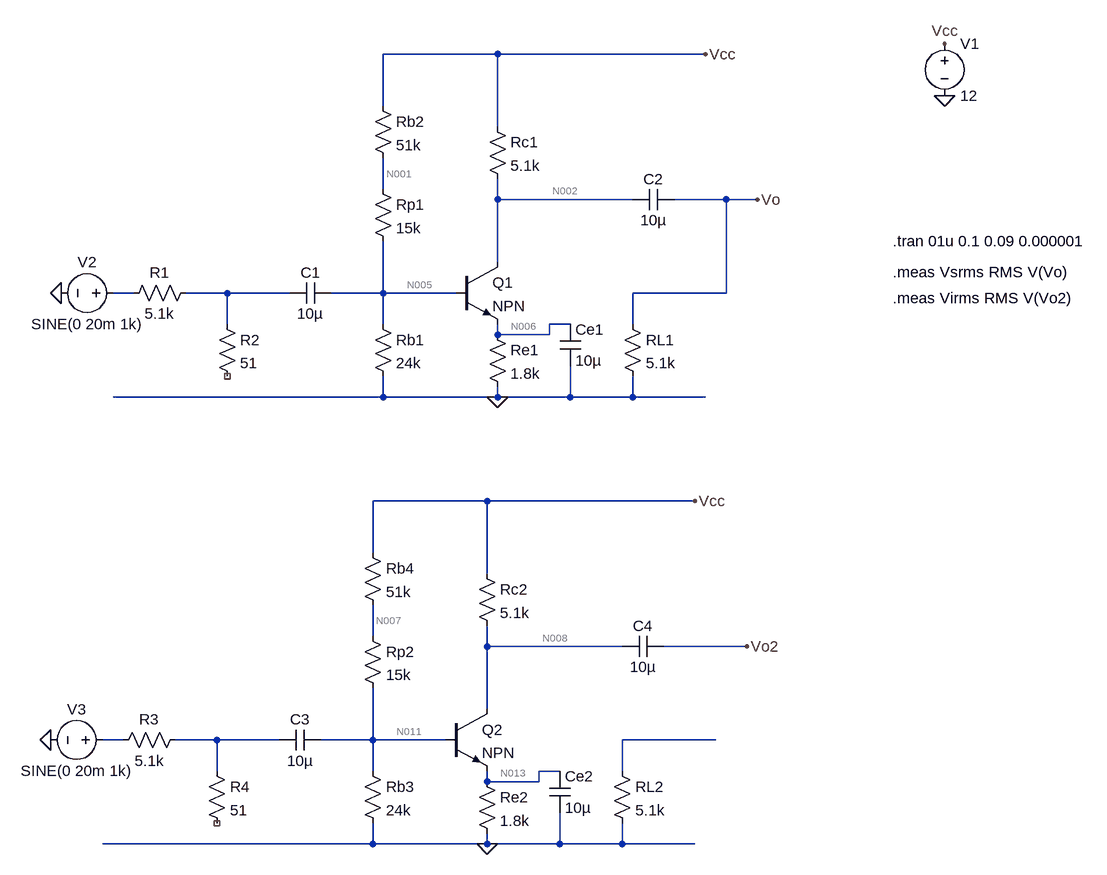
[diagram p0: schematic Experiment2_4_2.asc]
Experiment2_4_2.asc, the LTspice schematic file:
Version 4.1
SHEET 1 1064 1156
WIRE 128 -80 -48 -80
WIRE 448 -80 128 -80
WIRE -48 0 -48 -80
WIRE 128 32 128 -80
WIRE -48 128 -48 80
WIRE 128 144 128 112
WIRE 336 144 128 144
WIRE 480 144 400 144
WIRE 528 144 480 144
WIRE 128 240 128 144
WIRE -432 288 -464 288
WIRE -288 288 -352 288
WIRE -192 288 -288 288
WIRE -48 288 -48 208
WIRE -48 288 -128 288
WIRE 64 288 -48 288
WIRE 480 288 480 144
WIRE 480 288 336 288
WIRE -288 336 -288 288
WIRE -48 336 -48 288
WIRE 240 336 208 336
WIRE 336 336 336 288
WIRE 128 352 128 336
WIRE 208 352 208 336
WIRE 208 352 128 352
WIRE -48 448 -48 416
WIRE -48 448 -464 448
WIRE 128 448 128 432
WIRE 128 448 -48 448
WIRE 240 448 240 400
WIRE 240 448 128 448
WIRE 336 448 336 416
WIRE 336 448 240 448
WIRE 448 448 336 448
WIRE 112 608 -64 608
WIRE 432 608 112 608
WIRE -64 688 -64 608
WIRE 112 720 112 608
WIRE -64 816 -64 768
WIRE 112 832 112 800
WIRE 320 832 112 832
WIRE 512 832 384 832
WIRE 112 928 112 832
WIRE -448 976 -480 976
WIRE -304 976 -368 976
WIRE -208 976 -304 976
WIRE -64 976 -64 896
WIRE -64 976 -144 976
WIRE 48 976 -64 976
WIRE 464 976 320 976
WIRE -304 1024 -304 976
WIRE -64 1024 -64 976
WIRE 224 1024 192 1024
WIRE 320 1024 320 976
WIRE 112 1040 112 1024
WIRE 192 1040 192 1024
WIRE 192 1040 112 1040
WIRE -64 1136 -64 1104
WIRE -64 1136 -480 1136
WIRE 112 1136 112 1120
WIRE 112 1136 -64 1136
WIRE 224 1136 224 1088
WIRE 224 1136 112 1136
WIRE 320 1136 320 1104
WIRE 320 1136 224 1136
WIRE 432 1136 320 1136
FLAG 128 448 0
FLAG 448 -80 Vcc
FLAG 816 -96 Vcc
FLAG 816 -16 0
FLAG 528 144 Vo
FLAG -544 288 0
FLAG 112 1136 0
FLAG 432 608 Vcc
FLAG 512 832 Vo2
FLAG -560 976 0
SYMBOL res -336 272 R90
WINDOW 0 0 56 VBottom 2
WINDOW 3 32 56 VTop 2
SYMATTR InstName R1
SYMATTR Value 5.1k
SYMBOL res -304 320 R0
SYMATTR InstName R2
SYMATTR Value 51
SYMBOL res -64 320 R0
SYMATTR InstName Rb1
SYMATTR Value 24k
SYMBOL res -64 112 R0
SYMATTR InstName Rp1
SYMATTR Value 15k
SYMBOL res -64 -16 R0
SYMATTR InstName Rb2
SYMATTR Value 51k
SYMBOL npn 64 240 R0
SYMATTR InstName Q1
SYMBOL res 112 336 R0
SYMATTR InstName Re1
SYMATTR Value 1.8k
SYMBOL res 320 320 R0
SYMATTR InstName RL1
SYMATTR Value 5.1k
SYMBOL res 112 16 R0
SYMATTR InstName Rc1
SYMATTR Value 5.1k
SYMBOL voltage 816 -112 R0
WINDOW 123 0 0 Left 0
WINDOW 39 0 0 Left 0
SYMATTR InstName V1
SYMATTR Value 12
SYMBOL cap -128 272 R90
WINDOW 0 0 32 VBottom 2
WINDOW 3 32 32 VTop 2
SYMATTR InstName C1
SYMATTR Value 10µ
SYMATTR SpiceLine V=6.3 Irms=0 Rser=4 Lser=0 mfg="AVX" pn="TAJA106M006" type="Tantalum"
SYMBOL cap 336 160 R270
WINDOW 0 32 32 VTop 2
WINDOW 3 0 32 VBottom 2
SYMATTR InstName C2
SYMATTR Value 10µ
SYMATTR SpiceLine V=6.3 Irms=0 Rser=4 Lser=0 mfg="AVX" pn="TAJA106M006" type="Tantalum"
SYMBOL cap 224 336 R0
SYMATTR Value 10µ
SYMATTR InstName Ce1
SYMATTR SpiceLine V=6.3 Irms=0 Rser=4 Lser=0 mfg="AVX" pn="TAJA106M006" type="Tantalum"
SYMBOL voltage -448 288 R90
WINDOW 0 -32 56 VBottom 2
WINDOW 3 32 56 VTop 2
WINDOW 123 0 0 Left 0
WINDOW 39 0 0 Left 0
SYMATTR InstName V2
SYMATTR Value SINE(0 20m 1k)
SYMBOL res -352 960 R90
WINDOW 0 0 56 VBottom 2
WINDOW 3 32 56 VTop 2
SYMATTR InstName R3
SYMATTR Value 5.1k
SYMBOL res -320 1008 R0
SYMATTR InstName R4
SYMATTR Value 51
SYMBOL res -80 1008 R0
SYMATTR InstName Rb3
SYMATTR Value 24k
SYMBOL res -80 800 R0
SYMATTR InstName Rp2
SYMATTR Value 15k
SYMBOL res -80 672 R0
SYMATTR InstName Rb4
SYMATTR Value 51k
SYMBOL npn 48 928 R0
SYMATTR InstName Q2
SYMBOL res 96 1024 R0
SYMATTR InstName Re2
SYMATTR Value 1.8k
SYMBOL res 304 1008 R0
SYMATTR InstName RL2
SYMATTR Value 5.1k
SYMBOL res 96 704 R0
SYMATTR InstName Rc2
SYMATTR Value 5.1k
SYMBOL cap -144 960 R90
WINDOW 0 0 32 VBottom 2
WINDOW 3 32 32 VTop 2
SYMATTR InstName C3
SYMATTR Value 10µ
SYMATTR SpiceLine V=6.3 Irms=0 Rser=4 Lser=0 mfg="AVX" pn="TAJA106M006" type="Tantalum"
SYMBOL cap 320 848 R270
WINDOW 0 32 32 VTop 2
WINDOW 3 0 32 VBottom 2
SYMATTR InstName C4
SYMATTR Value 10µ
SYMATTR SpiceLine V=6.3 Irms=0 Rser=4 Lser=0 mfg="AVX" pn="TAJA106M006" type="Tantalum"
SYMBOL cap 208 1024 R0
SYMATTR Value 10µ
SYMATTR InstName Ce2
SYMATTR SpiceLine V=6.3 Irms=0 Rser=4 Lser=0 mfg="AVX" pn="TAJA106M006" type="Tantalum"
SYMBOL voltage -464 976 R90
WINDOW 0 -32 56 VBottom 2
WINDOW 3 32 56 VTop 2
WINDOW 123 0 0 Left 0
WINDOW 39 0 0 Left 0
SYMATTR InstName V3
SYMATTR Value SINE(0 20m 1k)
TEXT 736 208 Left 2 !.tran 01u 0.1 0.09 0.000001
TEXT 736 256 Left 2 !.meas Vsrms RMS V(Vo)
TEXT 736 296 Left 2 !.meas Virms RMS V(Vo2)

The netlist it stands for:
* Experiment2_4_2.asc
R1 N004 N003 5.1k
R2 N004 NC_01 51
Rb1 N005 0 24k
Rp1 N001 N005 15k
Rb2 Vcc N001 51k
Q1 N002 N005 N006 0 NPN
Re1 N006 0 1.8k
RL1 Vo 0 5.1k
Rc1 Vcc N002 5.1k
V1 Vcc 0 12
C1 N005 N004 10µ V=6.3 Irms=0 Rser=4 Lser=0 mfg="AVX" pn="TAJA106M006" type="Tantalum"
C2 N002 Vo 10µ V=6.3 Irms=0 Rser=4 Lser=0 mfg="AVX" pn="TAJA106M006" type="Tantalum"
Ce1 N006 0 10µ V=6.3 Irms=0 Rser=4 Lser=0 mfg="AVX" pn="TAJA106M006" type="Tantalum"
V2 N003 0 SINE(0 20m 1k)
R3 N010 N009 5.1k
R4 N010 NC_02 51
Rb3 N011 0 24k
Rp2 N007 N011 15k
Rb4 Vcc N007 51k
Q2 N008 N011 N013 0 NPN
Re2 N013 0 1.8k
RL2 N012 0 5.1k
Rc2 Vcc N008 5.1k
C3 N011 N010 10µ V=6.3 Irms=0 Rser=4 Lser=0 mfg="AVX" pn="TAJA106M006" type="Tantalum"
C4 N008 Vo2 10µ V=6.3 Irms=0 Rser=4 Lser=0 mfg="AVX" pn="TAJA106M006" type="Tantalum"
Ce2 N013 0 10µ V=6.3 Irms=0 Rser=4 Lser=0 mfg="AVX" pn="TAJA106M006" type="Tantalum"
V3 N009 0 SINE(0 20m 1k)
.model NPN NPN
.model PNP PNP
.lib standard.bjt
.tran 01u 0.1 0.09 0.000001
.meas Vsrms RMS V(Vo)
.meas Virms RMS V(Vo2)
.backanno
.end

* Results of the author's LTspice run, read from the files saved beside the schematic
* Operating Point, zero values left out:
*   V(n005) = 2.986 V
*   V(n001) = 5.035 V
*   V(n002) = 5.809 V
*   V(n011) = 2.986 V
*   V(n008) = 5.809 V
*   V(vo2) = 5.809 V
*   V(vcc) = 12 V
*   V(n006) = 2.207 V
*   V(n007) = 5.035 V
*   V(n013) = 2.207 V
*   Ic(Q1) = 1.214 mA
*   Ib(Q1) = 12.14 µA
*   Ie(Q1) = -1.226 mA
*   I(Rb4) = 136.6 µA
*   I(Re2) = 1.226 mA
*   I(Rb1) = 124.4 µA
*   I(Rb2) = 136.6 µA
*   I(Rp1) = 136.6 µA
*   I(Re1) = 1.226 mA
*   I(V1) = -2.701 mA
*   I(Rb3) = 124.4 µA
*   I(Rp2) = 136.6 µA
*   Ic(Q2) = 1.214 mA
*   Ib(Q2) = 12.14 µA
*   Ie(Q2) = -1.226 mA
*   I(Rc2) = 1.214 mA
*   I(Rc1) = 1.214 mA
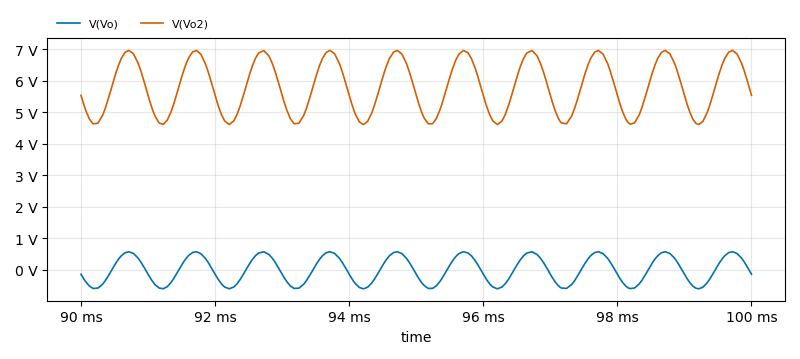
[diagram p1: Transient Analysis of Experiment2_4_2.asc, plotted from the saved traces]
* Transient Analysis, 1 run:
*   V(Vo): min -597.3 mV, max 578.9 mV, average -157.2 µV, rms 413.3 mV, last -135.1 mV
*   V(Vo2): min 4.613 V, max 6.966 V, average 5.808 V, rms 5.866 V, last 5.54 V
* From the log:
*   vsrms: RMS(V(Vo))=0.416088837786 FROM 0 TO 0.01
*   virms: RMS(V(Vo2))=5.86726440839 FROM 0 TO 0.01